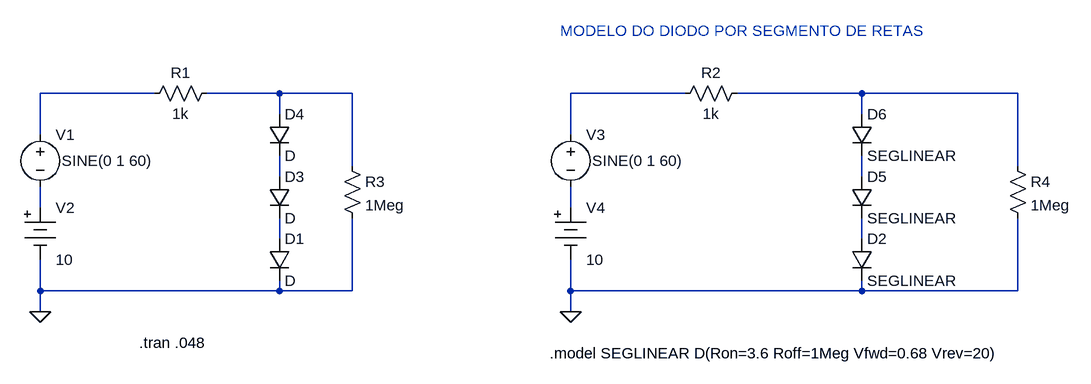
[diagram p0: schematic Diodo - Diodo_Pequenos_Sinais_Exemplo 2.asc]
Diodo - Diodo_Pequenos_Sinais_Exemplo 2.asc, the LTspice schematic file:
Version 4
SHEET 1 1492 680
WIRE 80 112 -96 112
WIRE 272 112 160 112
WIRE 384 112 272 112
WIRE 896 112 720 112
WIRE 1168 112 976 112
WIRE 1408 112 1168 112
WIRE 272 144 272 112
WIRE 1168 144 1168 112
WIRE -96 176 -96 112
WIRE 720 176 720 112
WIRE 384 224 384 112
WIRE 1408 224 1408 112
WIRE 272 240 272 208
WIRE 1168 240 1168 208
WIRE -96 288 -96 256
WIRE 720 288 720 256
WIRE 272 336 272 304
WIRE 1168 336 1168 304
WIRE -96 416 -96 368
WIRE 272 416 272 400
WIRE 272 416 -96 416
WIRE 384 416 384 304
WIRE 384 416 272 416
WIRE 720 416 720 368
WIRE 1168 416 1168 400
WIRE 1168 416 720 416
WIRE 1408 416 1408 304
WIRE 1408 416 1168 416
WIRE -96 448 -96 416
WIRE 720 448 720 416
FLAG -96 448 0
FLAG 720 448 0
SYMBOL voltage -96 160 R0
WINDOW 3 33 56 Left 2
WINDOW 123 0 0 Left 2
WINDOW 39 0 0 Left 2
SYMATTR Value SINE(0 1 60)
SYMATTR InstName V1
SYMBOL Misc\\battery -96 272 R0
SYMATTR InstName V2
SYMATTR Value 10
SYMATTR SpiceLine Rser=0
SYMBOL res 64 128 R270
WINDOW 0 32 56 VTop 2
WINDOW 3 0 56 VBottom 2
SYMATTR InstName R1
SYMATTR Value 1k
SYMBOL diode 256 336 R0
SYMATTR InstName D1
SYMBOL voltage 720 160 R0
WINDOW 3 33 56 Left 2
WINDOW 123 0 0 Left 2
WINDOW 39 0 0 Left 2
SYMATTR Value SINE(0 1 60)
SYMATTR InstName V3
SYMBOL Misc\\battery 720 272 R0
SYMATTR InstName V4
SYMATTR Value 10
SYMATTR SpiceLine Rser=0
SYMBOL res 880 128 R270
WINDOW 0 32 56 VTop 2
WINDOW 3 0 56 VBottom 2
SYMATTR InstName R2
SYMATTR Value 1k
SYMBOL diode 1152 336 R0
SYMATTR InstName D2
SYMATTR Value SEGLINEAR
SYMBOL diode 256 240 R0
SYMATTR InstName D3
SYMBOL diode 256 144 R0
SYMATTR InstName D4
SYMBOL res 368 208 R0
SYMATTR InstName R3
SYMATTR Value 1Meg
SYMBOL diode 1152 240 R0
SYMATTR InstName D5
SYMATTR Value SEGLINEAR
SYMBOL diode 1152 144 R0
SYMATTR InstName D6
SYMATTR Value SEGLINEAR
SYMBOL res 1392 208 R0
SYMATTR InstName R4
SYMATTR Value 1Meg
TEXT 56 496 Left 2 !.tran .048
TEXT 688 512 Left 2 !.model SEGLINEAR D(Ron=3.6 Roff=1Meg Vfwd=0.68 Vrev=20)
TEXT 704 16 Left 2 ;MODELO DO DIODO POR SEGMENTO DE RETAS

The netlist it stands for:
* Diodo - Diodo_Pequenos_Sinais_Exemplo 2.asc
V1 N001 N007 SINE(0 1 60)
V2 N007 0 10 Rser=0
R1 N001 N002 1k
D1 N009 0 D
V3 N003 N008 SINE(0 1 60)
V4 N008 0 10 Rser=0
R2 N003 N004 1k
D2 N010 0 SEGLINEAR
D3 N005 N009 D
D4 N002 N005 D
R3 N002 0 1Meg
D5 N006 N010 SEGLINEAR
D6 N004 N006 SEGLINEAR
R4 N004 0 1Meg
.model D D
.lib standard.dio
.tran .048
.model SEGLINEAR D(Ron=3.6 Roff=1Meg Vfwd=0.68 Vrev=20)
* MODELO DO DIODO POR SEGMENTO DE RETAS
.backanno
.end